# Altium schematic sheet SDR_wt_Schema.SchDoc
size A4
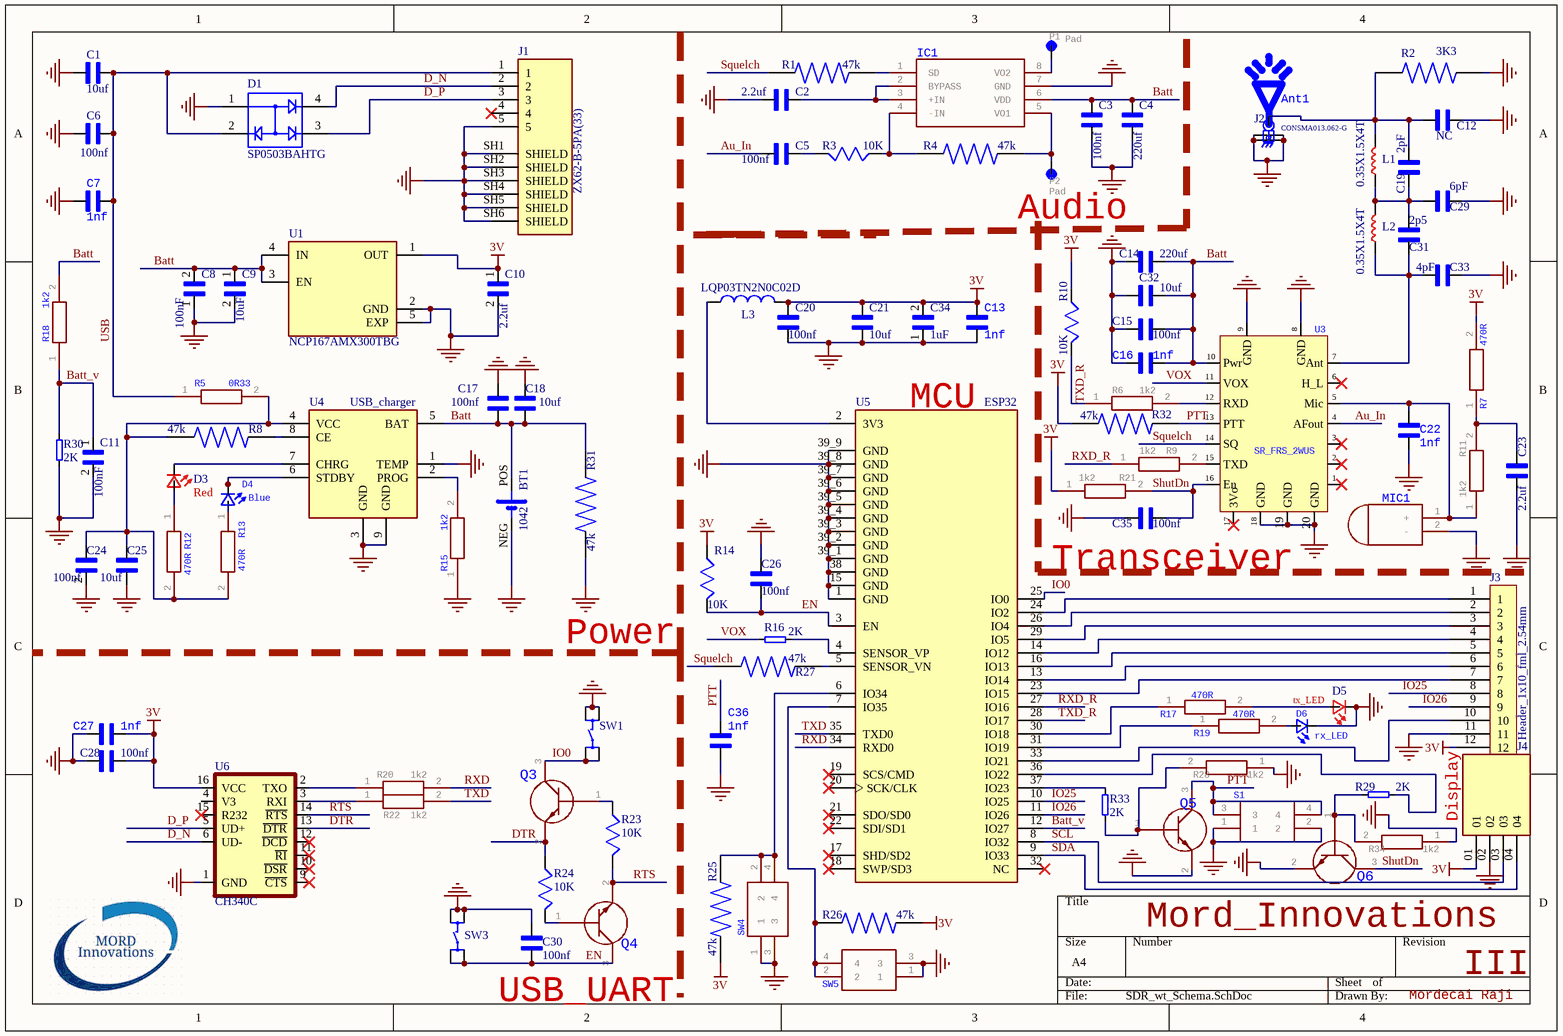
[diagram p0: SDR_wt_Schema.SchDoc]

## Parts
Ant1  UHF_Antenna  [Antenna]  (value not drawn)  (mechanical)
BT1  1042  [BAT_1042]
C1  10uf  [CAPC1608X90N]
C2  2.2uf  [2u2 cap 0805]
C3  100nf  [CAPC1005X55N]
C4  220uf  [220uf_3v3]
C5  100nf  [CAPC1005X55N]
C6  100nf  [CAPC1005X55N]
C7  1nf  [1nF CAP]
C8  100nF  [CAPC1005X55N]
C9  10uF  [CAPC1608X90N]
C10  2.2uf  [2u2 cap 0805]
C11  100nF  [CAPC1005X55N]
C12  NC  [CAPC1608X90N]
C13  1nf  [1nF CAP]
C14  220uf  [220uf_3v3]
C15  100nf  [CAPC1005X55N]
C16  1nf  [1nF CAP]
C17  100nf  [CAPC1005X55N]
C18  10uf  [CAPC1608X90N]
C19  2pF  [CAPC1608X90N]
C20  100nf  [CAPC1005X55N]
C21  10uf  [CAPC1608X90N]
C22  1nf  [1nF CAP]
C23  2.2uf  [2u2 cap 0805]
C24  100nf  [CAPC1005X55N]
C25  10uf  [CAPC1608X90N]
C26  100nf  [CAPC1005X55N]
C27  1nf  [1nF CAP]
C28  100nf  [CAPC1005X55N]
C29  6pF  [CAPC1608X90N]
C30  100nf  [CAPC1005X55N]
C31  2p5  [CAPC1608X90N]
C32  10uf  [CAPC1608X90N]
C33  4pF  [CAPC1608X90N]
C34  1uF  [CAPC1608X100N]
C35  100nf  [CAPC1005X55N]
C36  1nf  [1nF CAP]
D1  SP0503BAHTG  [TVS_SOT143]
D3  Red  [0603]
D4  Blue  [19217BHCZL1M2RY3T]
D5  tx_LED  [0603]
D6  rx_LED  [19217BHCZL1M2RY3T]
IC1  ic   Source:  Datasheet  [NS8002]  (value not drawn)
J1  ZX62-B-5PA(33)  [HRS_ZX62-B-5PA(33)]
J2  CONSMA013.062-G  [LINX_CONSMA013.062-G]
J3  Header_1x10_fml_2.54mm  [Header_1x12_fml_2.54mm]  (no BOM)
J4  SL-104-TT-11  [SAMTEC_SL-104-TT-11]  (value not drawn)  (no BOM)
L1  0.35X1.5X4T  [0.35X1.5X4T]
L2  0.35X1.5X4T  [0.35X1.5X4T]
L3  LQP03TN2N0C02D  [INDC0603X33N]
MIC1  Through Hole,P=1.4mm Electret Condenser Microphone   Source:  Datasheet  [GMI4015P2C42db]  (value not drawn)
P1  Pad  [pad_spkr]  (no BOM)
P2  Pad  [pad_spkr]  (no BOM)
Q3  Bipolar Transistors - BJT NPN TRANSISTOR 1.5A 40V   Source:  Datasheet  [SOT95P240X115-3N]  (value not drawn)
Q4  Bipolar Transistors - BJT NPN TRANSISTOR 1.5A 40V   Source:  Datasheet  [SOT95P240X115-3N]  (value not drawn)
Q5  Bipolar Transistors - BJT NPN TRANSISTOR 1.5A 40V   Source:  Datasheet  [SOT95P240X115-3N]  (value not drawn)
Q6  Bipolar Transistors - BJT NPN TRANSISTOR 1.5A 40V   Source:  Datasheet  [SOT95P240X115-3N]  (value not drawn)
R1  47k  [R0805_47K]
R2  3K3  [RESC2012X65N]
R3  10K  [R0805]
R4  47k  [R0805_47K]
R5  0R33  [RESC3126X65N]
R6  1k2  [RESC1608X55N 1K2]
R7  470R  [RESC1005X40N]
R8  47k  [R0805_47K]
R9  1k2  [RESC1608X55N 1K2]
R10  10K  [R0805]
R11  1k2  [RESC1608X55N 1K2]
R12  470R  [RESC1005X40N]
R13  470R  [RESC1005X40N]
R14  10K  [R0805]
R15  1k2  [RESC1608X55N 1K2]
R16  2K  [RESC1005X40N]
R17  470R  [RESC1005X40N]
R18  1k2  [RESC1608X55N 1K2]
R19  470R  [RESC1005X40N]
R20  1k2  [RESC1608X55N 1K2]
R21  1k2  [RESC1608X55N 1K2]
R22  1k2  [RESC1608X55N 1K2]
R23  10K  [R0805]
R24  10K  [R0805]
R25  47k  [R0805_47K]
R26  47k  [R0805_47K]
R27  47k  [R0805_47K]
R28  1k2  [RESC1608X55N 1K2]
R29  2K  [RESC1005X40N]
R30  2K  [RESC1005X40N]
R31  47k  [R0805_47K]
R32  47k  [R0805_47K]
R33  2K  [RESC1005X40N]
R34  1k2  [RESC1608X55N 1K2]
S1  Black Button Tactile Switch, SPST-NO 50 mA 0.65mm Surface Mount   Source:  Datasheet  [SKSCLAE010]  (value not drawn)
SW1  SKRPABE010  [SKRPABE010]  (value not drawn)
SW3  SKRPABE010  [SKRPABE010]  (value not drawn)
SW4  C & K COMPONENTS - PTS645SM43SMTR92LFS - SWITCH, SPST, 0.05A, 12VDC, SMD, 4.3MM   Source:  Datasheet  [PTS645(SMT)]  (value not drawn)
SW5  C & K COMPONENTS - PTS645SM43SMTR92LFS - SWITCH, SPST, 0.05A, 12VDC, SMD, 4.3MM   Source:  Datasheet  [PTS645(SMT)]  (value not drawn)
U1  NCP167AMX300TBG  [REG_NCP167BMX330TBG]
U3  SR_FRS_2WUS  [SR_FRS_2WUS]
U4  USB_charger  [TP4056]
U5  ESP32  [ESP32 foot]
U6  CH340C  [SO016]

## Nets
3V: C10.1 C13.1 C20.1 C21.1 C27.2 C28.1 C34.2 J3.12 J4.01 L3.2 R7.2 R10.1 R14.1 R21.1 R25.2 R26.2 R32.1 U1.1(OUT) U6.16(VCC)
GND: BT1.NEG C1.2 C2.2 C3.1 C4.1 C6.2 C7.1 C8.1 C9.2 C10.2 C11.2 C12.2 C13.2 C14.2 C15.2 C16.2 C17.1 C18.1 C20.2 C21.2 C22.2 C23.2 C24.2 C25.2 C26.2 C27.1 C28.2 C29.1 C30.1 C32.1 C33.2 C34.1 C35.2 C36.2 D1.1 D5.1(K2) D6.1(K2) IC1.7(GND) J1.5 J1.SH1(SHIELD) J1.SH2(SHIELD) J1.SH3(SHIELD) J1.SH4(SHIELD) J1.SH5(SHIELD) J1.SH6(SHIELD) J2.S1 J2.S2 J2.S3 J2.S4 J3.11 J4.02 MIC1.2(-) Q5.2(E) Q6.2(E) R2.2 R15.1 R28.1 R30.1 R31.1 R34.1 S1.1 S1.2 SW1.P$3 SW1.P$4 SW3.P$3 SW3.P$4 SW4.1 SW4.3 SW5.1 SW5.3 U1.2(GND) U1.5(EXP) U3.8(GND) U3.9(GND) U3.18(GND) U3.19(GND) U3.20(GND) U4.1(TEMP) U4.3(GND) U4.9(GND) U5.1(GND) U5.15(GND) U5.38(GND) U5.39_1(GND) U5.39_2(GND) U5.39_3(GND) U5.39_4(GND) U5.39_5(GND) U5.39_6(GND) U5.39_7(GND) U5.39_8(GND) U5.39_9(GND) U6.1(GND)
Au_In: C5.2 U3.4(AFout)
Batt: BT1.POS C3.2 C4.2 C8.2 C9.1 C14.1 C15.1 C16.1 C17.2 C18.2 C32.2 IC1.6(VDD) R18.2 R31.2 U1.3(EN) U1.4(IN) U3.10(Pwr) U4.5(BAT)
Batt_v: C11.1 R18.1 R30.2 U5.12(IO27)
D_N: D1.4 J1.2 U6.6(UD-)
D_P: D1.3 J1.3 U6.5(UD+)
DTR: Q3.2(E) R24.1 U6.13(~{DTR})
EN: C26.1 C30.2 Q4.3(C) R14.2 SW3.P$1 SW3.P$2 U5.3(EN)
IO0: Q3.3(C) SW1.P$1 SW1.P$2 U5.25(IO0)
IO25: J3.8 U5.10(IO25)
IO26: J3.9 U5.11(IO26)
PTT: C36.1 Q5.3(C) R32.2 S1.3 S1.4 U3.13(PTT)
RTS: Q4.2(E) R23.2 U6.14(~{RTS})
RXD: R20.2 U5.34(RXD0)
RXD_R: R9.1 U5.27(IO16)
SCL: J4.03 U5.8(IO32)
SDA: J4.04 U5.9(IO33)
ShutDn: C35.1 Q6.3(C) R21.2 U3.16(En)
Squelch: R1.1 R27.1 U3.14(SQ)
TXD: R22.2 U5.35(TXD0)
TXD_R: R6.1 R10.2 U5.28(IO17)
USB: C1.1 C6.1 C7.2 D1.2 J1.1 R5.1
VOX: R16.1 U3.11(VOX)
NetC2_1: C2.1 IC1.2(BYPASS) IC1.3(+IN)
NetC5_1: C5.1 R3.2
NetC12_1: C12.1 C19.2 J2.1 L1.2 R2.1
NetC19_1: C19.1 C29.2 C31.2 L1.1 L2.2
NetC22_1: C22.1 MIC1.1(+) R11.1 U3.5(Mic)
NetC23_1: C23.1 R7.1 R11.2
NetC24_1: C24.1 C25.1 R5.2 R8.1 R12.2 R13.2 U4.4(VCC)
NetC31_1: C31.1 C33.1 L2.1 U3.7(Ant)
NetD3_1: D3.1(K2) U4.7(CHRG)
NetD3_2: D3.2(A2) R12.1
NetD4_1: D4.1(K2) U4.6(STDBY)
NetD4_2: D4.2(A2) R13.1
NetD5_2: D5.2(A2) R17.2
NetD6_2: D6.2(A2) R19.2
NetIC1_1: IC1.1(SD) R1.2
NetIC1_4: IC1.4(-IN) R3.1 R4.1
NetIC1_5: IC1.5(VO1) P2.1 R4.2
NetIC1_8: IC1.8(VO2) P1.1
NetJ3_1: J3.1 U5.24(IO2)
NetJ3_2: J3.2 U5.26(IO4)
NetJ3_3: J3.3 U5.29(IO5)
NetJ3_4: J3.4 U5.14(IO12)
NetJ3_5: J3.5 U5.16(IO13)
NetJ3_6: J3.6 U5.13(IO14)
NetJ3_7: J3.7 U5.23(IO15)
NetJ3_10: J3.10 U5.33(IO21)
NetL3_1: L3.1 U5.2(3V3)
NetQ3_1: Q3.1(B) R23.1
NetQ4_1: Q4.1(B) R24.2
NetQ5_1: Q5.1(B) R28.2 R33.1
NetQ6_1: Q6.1(B) R29.2 R34.2
NetR6_2: R6.2 U3.12(RXD)
NetR8_2: R8.2 U4.8(CE)
NetR9_2: R9.2 U3.15(TXD)
NetR15_2: R15.2 U4.2(PROG)
NetR16_2: R16.2 U5.4(SENSOR_VP)
NetR17_1: R17.1 U5.30(IO18)
NetR19_1: R19.1 U5.31(IO19)
NetR20_1: R20.1 U6.2(TXO)
NetR22_1: R22.1 U6.3(RXI)
NetR25_1: R25.1 SW4.2 SW4.4 U5.6(IO34)
NetR26_1: R26.1 SW5.2 SW5.4 U5.7(IO35)
NetR27_2: R27.2 U5.5(SENSOR_VN)
NetR29_1: R29.1 U5.36(IO22)
NetR33_2: R33.2 U5.37(IO23)

Not connected (* = marked no-connect by the designer): J1 4*; U3 1(19)* 2* 3* 6(H_L)* 17(3Vo)*; U5 17(SHD/SD2)* 18(SWP/SD3)* 19(SCS/CMD)* 20(SCK/CLK)* 21(SDO/SD0)* 22(SDI/SD1)* 32(NC)*; U6 4(V3) 9(~{CTS})* 10(~{DSR})* 11(~{RI})* 12(~{DCD})* 15(R232)*

## Notes on the sheet
- (near P2) Audio
- (near U5) MCU
- Transceiver
- Power
- Display
- Mord_Innovations
- III
- USB_UART
- Mordecai Raji

## Library data of the parts
Ant1 = Antenna
BT1 = 1042: RF EMI Absorbing Sheet Q-ZorbÂ® Silicone Rubber Non-Conductive, Single Sided 24.000 _609.60mm_ X 24.000 _609.60mm_ X 0.094 _2.40mm_; MF: Laird Technologies; Package: 0402 Laird Technologies; Value: *; Price: None; MP: 1042; SnapEDA_Link: https://www.snapeda.com/parts/1042/Laird%20Technologies%20EMI/view-part/238870/?ref=snap; Availability: Unavailable; LCSC Part #: *
C1 C9 C18 C21 C25 C32 = 10uf: 10ÂµF Â±10% 10V Ceramic Capacitor X5R 0603 _1608 Metric_; MP: CL10A106KP8NNNC; MF: Samsung; SnapEDA_Link: https://www.snapeda.com/parts/CL10A106KP8NNNC/Samsung/view-part/3598152/?ref=snap; Price: None; Package: 0603 Samsung; Availability: Unavailable; Value: *; LCSC Part #: C19702
C2 C10 C23 = GRM21BR71A225KA01L: SMT 0805 ceramic cap X7R 10V 2.2uF; Package: None; Price: None; Value: *; MP: GRM21BR71A225KA01L; Availability: Unavailable
C3 C5 C6 C8 C11 C15 C17 C20 C24 C26 C28 C30 C35 = 100nf: 0.1ÂµF Â±10% 16V Ceramic Capacitor X7R 0402 _1005 Metric_; MP: CL05B104KO5NNNC; MF: Samsung Electro-Mechanics; Price: None; SnapEDA_Link: https://www.snapeda.com/parts/CL05B104KO5NNNC/Samsung%20Electro-Mechanics/view-part/3598311/?ref=snap; Package: 0402 Samsung; Value: *; Availability: Unavailable; LCSC Part #: C1525
C4 C14 = 220uf_6v3: GRM31CR60J227ME11L; MF: Murata Electronics; Digi-Key_Part_Number: 490-13970-1-ND; Package: 3216 Murata; MP: GRM31CR60J227ME11L; SnapEDA_Link: https://www.snapeda.com/parts/GRM31CR60J227ME11L/Murata%20Electronics%20North%20America/view-part/1756709/?ref=snap; Purchase-URL: https://pricing.snapeda.com/search/part/GRM31CR60J227ME11L/?ref=eda; Check_prices: https://www.snapeda.com/parts/GRM31CR60J227ME11L/Murata%20Electronics%20North%20America/view-part/1756709/?ref=eda; Value: *
C7 C13 C16 C22 C27 C36 = 1nF CAP
C12 = GCM1885C2A2R0BA16D: SMD Capacitor C0G(EIA) with Capacitance: 2.0pF Tol. 0.1pF. Rated Voltage: 100Vdc; Value: 2pF; Package: None; Price: None; MP: GCM1885C2A2R0BA16D; Availability: Unavailable
C19 = GCM1885C2A2R0BA16D: SMD Capacitor C0G(EIA) with Capacitance: 2.0pF Tol. 0.1pF. Rated Voltage: 100Vdc; Package: None; Price: None; Value: 2pF; MP: GCM1885C2A2R0BA16D; Availability: Unavailable
C29 = GCM1885C2A6R0BA16D: SMD Capacitor C0G(EIA) with Capacitance: 6.0pF Tol. 0.1pF. Rated Voltage: 100Vdc; Package: None; Price: None; Value: 6pF; MP: GCM1885C2A6R0BA16D; Availability: Unavailable
C31 = GCM1885C2A2R5BA16D: SMD Capacitor C0G(EIA) with Capacitance: 2.5pF Tol. 0.1pF. Rated Voltage: 100Vdc; Package: None; Price: None; Value: 2p5; MP: GCM1885C2A2R5BA16D; Availability: Unavailable
C33 = GCM1885C2A4R0BA16D: SMD Capacitor C0G(EIA) with Capacitance: 4.0pF Tol. 0.1pF. Rated Voltage: 100Vdc; Package: None; Price: None; Value: 4pF; MP: GCM1885C2A4R0BA16D; Availability: Unavailable
C34 = CL10A105KP8NNNC: 1ÂµF Â±10% 10V Ceramic Capacitor X5R 0603 _1608 Metric_; MF: Samsung Electro-Mechanics; Package: 0603 Samsung Electro-Mechanics; Value: 1uF; Price: None; MP: CL10A105KP8NNNC; SnapEDA_Link: https://www.snapeda.com/parts/CL10A105KP8NNNC/Samsung%20Electro-Mechanics/view-part/2784099/?ref=snap; Availability: Unavailable
D1 = SP0503BAHTG: 8.5V Clamp Ipp Tvs Diode Surface Mount SOT-143-4; MF: Littelfuse Inc.; MP: SP0503BAHTG; Package: SOT-143 Littelfuse; SnapEDA_Link: https://www.snapeda.com/parts/SP0503BAHTG/Littelfuse%20Inc./view-part/214427/?ref=snap; Digi-Key_Purchase_URL: https://www.digikey.com/product-detail/en/littelfuse-inc/SP0503BAHTG/F2715CT-ND/1154322?utm_source=snapeda&utm_medium=aggregator&utm_campaign=symbol; Value: *; Digi-Key_Part_Number: F2715CT-ND
D3 D5 = Red LED: Red 631nm LED Indication - Discrete 2V 0603 _1608 Metric_; MF: Lite-On Inc.; MP: LTST-C191KRKT; Parameter 1: C125099; Value: *; Package: 0603 Lite-On; Digi-Key_Purchase_URL: https://www.digikey.in/product-detail/en/lite-on-inc/LTST-C191KRKT/160-1447-1-ND/386836?utm_source=snapeda&utm_medium=aggregator&utm_campaign=symbol; SnapEDA_Link: https://www.snapeda.com/parts/LTST-C191KRKT/Lite-On%20Inc./view-part/234319/?ref=snap; Digi-Key_Part_Number: 160-1447-1-ND
D4 D6 = Blue_LED: Manufacturer_Name: Everlight; Manufacturer_Part_Number: 19-217/BHC-ZL1M2RY/3T; GateName_1: G$1; SymbolName_1: 19-217_BHC-ZL1M2RY_3T; LibraryName: 19-217_BHC-ZL1M2RY_3T; DeviceSetName: 19-217_BHC-ZL1M2RY_3T; Package: 19217BHCZL1M2RY3T; Height: 0.45mm; LCSC Part #: C72041
IC1 = LM4871: Manufacturer_Name: HGSEMI; GateName_1: G$1; SymbolName_1: LM4871; LibraryName: LM4871; DeviceSetName: LM4871; Package: SOIC127P600X165-8N; Manufacturer_Part_Number: LM4871; Height: 1.65mm
J1 = ZX62-B-5PA(33): USB - micro B USB 2.0 Receptacle Connector 5 Position Surface Mount, Right Angle; MP: ZX62-B-5PA_33_; MF: Hirose; Price: None; Package: None; Value: *; Availability: Unavailable; SnapEDA_Link: https://www.snapeda.com/parts/ZX62-B-5PA%2833%29/Hirose%20Electric%20Co%20Ltd/view-part/524781/?ref=snap
J2 = CONSMA013.062-G: SMA MALE EDGE MOUNT FOR 0.031" THICK BOARD; Availability: Unavailable; Price: None; Package: None; MP: CONSMA013.062-G; Value: *
J3 = 61301011821: WURTH ELEKTRONIK - 61301011821 - PCB Receptacle, Board-to-Board, 2.54 mm, 1 Rows, 10 Contacts, Through Hole Straight, WR-PHD Series; Manufacturer: Wurth Electronics; Current Rating: 3A; Voltage Rating: 250V; Number of Positions: 10; Insulation: Insulated; Insulation Resistance: 1GR; Connector Type: Header,Socket; Pitch: 2.54mm; Manufacturer Part Number: 61301011821; RoHS: Yes; Stock 1: 1388; Pricing 1: 1=0.65000, 10=0.64100, 50=0.59100, 100=0.54200, 320=0.49300 (USD); Mount: Through Hole; Contact Plating: Gold; Contact Material: Copper Alloy,Copper; Color: Black; Housing Material: PBT; Min Operating Temperature: -40°C; Max Operating Temperature: 125°C; Number of Rows: 1; Package Quantity: 320; Packaging: Tray; Contact Gender: Female; Termination: Through Hole; Gender: Receptacle; Number of Contacts: 10; Length: 25.9mm; Width: 25.9mm; Height: 8.5mm; REACH SVHC: Unknown; Flammability Rating: UL94 V-0; Lead Free: Lead Free; ComponentLink1URL: https://datasheet.ciiva.com/755/6130xx11821-755848.pdf?src-supplier=Digi-Key; ComponentLink1Description: https://datasheet.ciiva.com/755/6130xx11821-755848.pdf?src-supplier=Digi-Key; ComponentLink2URL: https://datasheet.ciiva.com/8043/1320173-8043339.pdf?src-supplier=Element14; ComponentLink2Description: https://datasheet.ciiva.com/8043/1320173-8043339.pdf?src-supplier=Element14; ComponentLink3URL: https://datasheet.ciiva.com/48686/001088188-da-01-en-wr-phd-buchsenleiste-61301011821-48686454.pdf?src-supplier=Conrad; ComponentLink3Description: https://datasheet.ciiva.com/48686/001088188-da-01-en-wr-phd-buchsenleiste-61301011821-48686454.pdf?src-supplier=Conrad; Category: Headers and Wire Housings; Supplier 1: Digi-Key; Supplier Part Number 1: 732-2859-ND
L3 = LQP03TN2N0C02D: FIXED IND 2NH 600MA 150 MOHM SMD; Package: None; Price: None; Value: *; MP: LQP03TN2N0C02D; Availability: Unavailable
MIC1 = GMI4015P-2C-42DB: Manufacturer_Name: INGHAi; GateName_1: G$1; SymbolName_1: GMI4015P-2C-42DB; LibraryName: GMI4015P-2C-42db; DeviceSetName: GMI4015P-2C-42DB; Package: GMI4015P2C42db; Manufacturer_Part_Number: GMI4015P-2C-42db; Height: 1.85mm
P1 P2 = spk_pad
Q3-Q6 = SS8050-G: Manufacturer_Name: Comchip Technology; GateName_1: G$1; SymbolName_1: SS8050-G; LibraryName: SS8050-G; DeviceSetName: SS8050-G; Package: SOT95P240X115-3N; Manufacturer_Part_Number: SS8050-G; Mouser_Part_Number: 750-SS8050-G; Mouser_Price-Stock: https://www.mouser.co.uk/ProductDetail/Comchip-Technology/SS8050-G?qs=LLUE9lz1YbcHg%252BWLMAtcrQ%3D%3D; Arrow_Part_Number: SS8050-G; Arrow_Price-Stock: https://www.arrow.com/en/products/ss8050-g/comchip-technology; Height: 1.15mm
R1 R4 R8 R25-R27 R31 R32 = CRGCQ0805F47K: Fixed Resistor CRGCQ 0805 47K 1%; Package: None; Price: None; Value: *; MP: CRGCQ0805F47K; Availability: Unavailable
R2 = CRGCQ0805F3K3: Fixed Resistor CRGCQ 0805 3K3 1%; Package: None; Price: None; Value: *; MP: CRGCQ0805F3K3; Availability: Unavailable
R3 R10 R14 R23 R24 = RC0805FR-0710KL: RES SMD 10K OHM 1% 1/8W 0805; Manufacturer: Yageo; Resistance: 10kR; Temperature Coefficient: 100ppm/°C; Power Rating: 125mW; Voltage Rating: 150V; Supplier 1: Digi-Key; Supplier Part Number 1: 311-10.0KCRCT-ND; Manufacturer Part Number: RC0805FR-0710KL; RoHS: Yes; Category: Chip SMD Resistors; Stock 1: 15417266; Pricing 1: 1=0.10000, 10=0.03600, 100=0.01470, 1000=0.00660, 2500=0.00573 (USD); Case/Package: 0805; Case Code (Imperial): 0805; Case Code (Metric): 2012; Min Operating Temperature: -55°C; Max Operating Temperature: 155°C; Tolerance: 1%; Resistor Type: Thick Film; Packaging: Tape and Reel; Package Quantity: 1; Termination: SMD/SMT; Number of Terminations: 2; Max Power Dissipation: 125mW; Features: Moisture Resistant; Length: 2mm; Width: 0.049inch; Height: 0.024inch; Depth: 1.25mm; REACH SVHC: Unknown; Lead Free: Lead Free; Military Standard: Not; ComponentLink1URL: https://datasheet.ciiva.com/11808/0900766b8106beab-11808151.pdf?src-supplier=RSComponents; ComponentLink1Description: https://datasheet.ciiva.com/11808/0900766b8106beab-11808151.pdf?src-supplier=RSComponents; ComponentLink2URL: https://datasheet.ciiva.com/12669/rc0805-12669688.pdf?src-supplier=Mouser; ComponentLink2Description: https://datasheet.ciiva.com/12669/rc0805-12669688.pdf?src-supplier=Mouser; ComponentLink3URL: https://datasheet.ciiva.com/46447/444164-46447563.pdf?src-supplier=Element14; ComponentLink3Description: https://datasheet.ciiva.com/46447/444164-46447563.pdf?src-supplier=Element14; ComponentLink4URL: https://datasheet.ciiva.com/2456/pyu-r-int-thick-7-2456972.pdf?src-supplier=Digi-Key; ComponentLink4Description: https://datasheet.ciiva.com/2456/pyu-r-int-thick-7-2456972.pdf?src-supplier=Digi-Key; ComponentLink5URL: https://datasheet.ciiva.com/2456/pyu-r-int-thick-7-2456973.pdf?src-supplier=Digi-Key; ComponentLink5Description: https://datasheet.ciiva.com/2456/pyu-r-int-thick-7-2456973.pdf?src-supplier=Digi-Key; ComponentLink6URL: https://datasheet.ciiva.com/2456/pyu-r-int-thick-7-2456974.pdf?src-supplier=Digi-Key; ComponentLink6Description: https://datasheet.ciiva.com/2456/pyu-r-int-thick-7-2456974.pdf?src-supplier=Digi-Key; ComponentLink7URL: https://datasheet.ciiva.com/16747/rc0805-16747087.pdf?src-supplier=Future+Electronics; ComponentLink7Description: https://datasheet.ciiva.com/16747/rc0805-16747087.pdf?src-supplier=Future+Electronics
R5 = 0R33: Manufacturer_Name: UNI-ROYAL(Uniroyal Elec); GateName_1: G$1; SymbolName_1: 1210W2F330LT5E; LibraryName: 1210W2F330LT5E; DeviceSetName: 1210W2F330LT5E; Package: RESC3126X65N; Manufacturer_Part_Number: 1210W2F330LT5E; Height: 0.65mm; LCSC Part #: C95211
R6 R9 R11 R15 R18 R20-R22 R28 R34 = 1K2: 0603WAF1201T5E; Manufacturer_Name: UNI-ROYAL(Uniroyal Elec); GateName_1: G$1; SymbolName_1: 0603WAF1201T5E; LibraryName: 0603WAF1201T5E; DeviceSetName: 0603WAF1201T5E; Package: RESC1608X55N; Manufacturer_Part_Number: 0603WAF1201T5E; Height: 0.55mm; LCSC Part #: C22765
R7 R12 R13 R17 R19 = 470R: Manufacturer_Name: Uniroyal Elec; GateName_1: G$1; SymbolName_1: 0402WGF4700TCE; LibraryName: 0402WGF4700TCE; DeviceSetName: 0402WGF4700TCE; Package: RESC1005X40N; Manufacturer_Part_Number: 0402WGF4700TCE; Height: 0.4mm; LCSC Part #: C25117
R16 R29 R30 R33 = 2K: AC Series 0402 0.063 W 2 kOhm Â±1% Â±100 ppm/Â°C SMT Thick Film Chip Resistor; MP: AC0402FR-072KL; Package: None; Price: None; Value: 2K; Availability: Unavailable; LCSC Part #: C144770
S1 = SKSCLAE010: Manufacturer_Name: ALPS Electric; GateName_1: G$1; SymbolName_1: SKSCLAE010; LibraryName: SKSCLAE010; DeviceSetName: SKSCLAE010; Package: SKSCLAE010; Manufacturer_Part_Number: SKSCLAE010; Mouser_Part_Number: 688-SKSCLAE010; Mouser_Price-Stock: https://www.mouser.com/Search/Refine.aspx?Keyword=688-SKSCLAE010; Height: 1.4mm
SW1 SW3 = Tactile_PTT_SKRPABE010: Switch Tactile N.O. SPST Button J-Bend 0.05A 16VDC 1.57N SMD Automotive T/R; MF: ALPS; Availability: Unavailable; Price: None; SnapEDA_Link: https://www.snapeda.com/parts/SKRPABE010/ALPS/view-part/652544/?ref=snap; Value: *; MP: SKRPABE010; Package: None
SW4 SW5 = Tactile_PTS645SM43SMTR92LFS: GateName_1: G$1; SymbolName_1: PTS645SM43SMTR92LFS; LibraryName: PTS645SM43SMTR92LFS; DeviceSetName: PTS645SM43SMTR92LFS; Package: PTS645(SMT); Manufacturer_Name: C & K COMPONENTS; Manufacturer_Part_Number: PTS645SM43SMTR92LFS; Mouser_Part_Number: 611-PTS645SM43SMTR92; Mouser_Price-Stock: https://www.mouser.co.uk/ProductDetail/CK/PTS645SM43SMTR92LFS?qs=FESYatJ8odKPktxv6ncfWg%3D%3D; Arrow_Part_Number: PTS645SM43SMTR92LFS; Arrow_Price-Stock: https://www.arrow.com/en/products/pts645sm43smtr92lfs/ck; Height: mm
U1 = NCP167BMX330TBG: Linear Voltage Regulator IC 1 Output 700mA 4-XDFN _1x1_; MF: ON Semiconductor; MP: NCP167BMX300TBG; Digi-Key_Part_Number: NCP167BMX300TBGOSCT-ND; Package: XDFN-4 ON Semiconductor; SnapEDA_Link: https://www.snapeda.com/parts/NCP167BMX330TBG/ON%20Semiconductor/view-part/3624496/?ref=snap; Digi-Key_Purchase_URL: https://www.digikey.de/product-detail/en/on-semiconductor/NCP167BMX330TBG/NCP167BMX330TBGOSCT-ND/9749419?utm_source=snapeda&utm_medium=aggregator&utm_campaign=symbol; Value: *
U4 = TP4056: Complete single cell Li-Ion battery with a constant current / constant voltage linear charger; MF: NanJing Top Power ASIC Corp.; Package: Package Analog Devices; MP: TP4056; Value: *; SnapEDA_Link: https://www.snapeda.com/parts/TP4056%20/NanJing%20Top%20Power%20ASIC%20Corp./view-part/2888426/?ref=snap; Price: None; Availability: Unavailable; LCSC Part #: C16581
U5 = ESP32-WROOM-32: SMD MODULE, ESP32-WROOM-32, ESP32-D0WDQ6; Manufacturer: Espressif Systems; Frequency: 2.5GHz; Data Rate: 150Mbps; Sensitivity: -98dBm; Operating Supply Voltage: 3.6V; Supplier 1: Digi-Key; Supplier Part Number 1: 1904-1010-1-ND; Manufacturer Part Number: ESP32-WROOM-32; RoHS: No; Category: RF Receivers, Transceivers; Pricing 1: 1=3.80000 (USD); Mount: Surface Mount; Case/Package: SMD/SMT; Weight: 0.088185oz; Min Operating Temperature: -40°C; Max Operating Temperature: 85°C; Packaging: Cut Tape; Package Quantity: 550; ComponentLink1URL: https://datasheet.ciiva.com/70828/esp32-wroom-32-datasheet-en-70828769.pdf?src-supplier=Digi-Key; ComponentLink1Description: https://datasheet.ciiva.com/70828/esp32-wroom-32-datasheet-en-70828769.pdf?src-supplier=Digi-Key; ComponentLink2URL: https://datasheet.ciiva.com/69725/esp32-datasheet-en-69725253.pdf?src-supplier=Digi-Key; ComponentLink2Description: https://datasheet.ciiva.com/69725/esp32-datasheet-en-69725253.pdf?src-supplier=Digi-Key
U6 = CH340C: USB to serial chip CH340; MF: WCH; Package: Package; Check_prices: https://www.snapeda.com/parts/CH340C/WCH/view-part/5428851/?ref=eda; Value: *; Price: None; MP: CH340C; Availability: Unavailable; SnapEDA_Link: https://www.snapeda.com/parts/CH340C/WCH/view-part/5428851/?ref=snap
J4 = SL-104-TT-11: Package: None; Price: None; Value: *; MP: SL-104-TT-11; Availability: Unavailable